# Altium schematic sheet Block-Diagram.SchDoc: USB-RTD Reader
size A4; Revision: 1.0; SheetNumber: 1; SheetTotal: 3
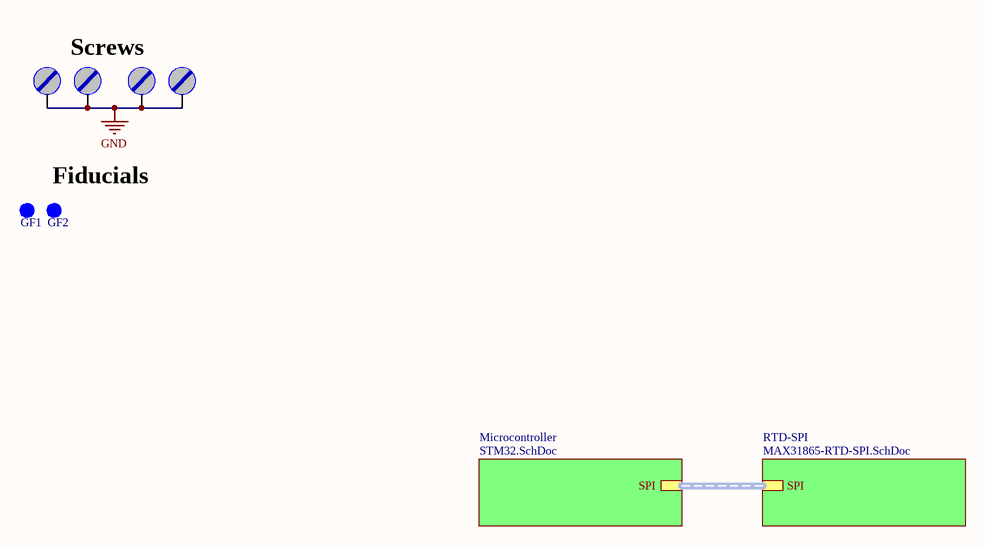
[diagram p0: Block-Diagram.SchDoc]

## Parts
GF1  Fiducial  [FIDUCIAL 1mm]  (value not drawn)  (no BOM)
GF2  Fiducial  [FIDUCIAL 1mm]  (value not drawn)  (no BOM)
M1  Furo de Fixação  [Furo_M3]  (value not drawn)  (no BOM)
M2  Furo de Fixação  [Furo_M3]  (value not drawn)  (no BOM)
M3  Furo de Fixação  [Furo_M3]  (value not drawn)  (no BOM)
M4  Furo de Fixação  [Furo_M3]  (value not drawn)  (no BOM)

## Sub-sheets
Microcontroller = STM32.SchDoc: SPI (harness SPI)
RTD-SPI = MAX31865-RTD-SPI.SchDoc: SPI (harness SPI)

## Nets
GND: M1.X M2.X M3.X M4.X

## Buses and harness runs
harness sheet Microcontroller/SPI = sheet RTD-SPI/SPI

## Notes on the sheet
- Screws
- Fiducials
- Projeto:
- Tamanho:
- Data:
- A4
- Eng. Felipe Navarro
- Hora:
- Revisão:
- Folha
- de
- Arquivo:

## Library data of the parts
GF1 GF2 = Fiducial: Guia Fiducial; ChinesePrice: 0,00000; Chinês: ----; Corrente: *; Potência: *; Supplier 1: Digi-Key; Supplier Part Number 1: --Del; Tensão: *; Value: *; Obs:: *; Tolerância: *; ComponentLink1Description: Datasheet; ComponentLink1URL: D:\Tecnoclade\Datasheet\
M1-M4 = Parafuso: Furo para parafuso; Value: M3; ChinesePrice: 0,00000; Chinês: ----; Supplier 1: Digi-Key; Supplier Part Number 1: --Del; Corrente: *; Potência: *; Tensão: *; Tolerância: *; Obs:: *; ComponentLink1Description: Datasheet; ComponentLink1URL: D:\Tecnoclade\Datasheet\!DataMissing.pdf